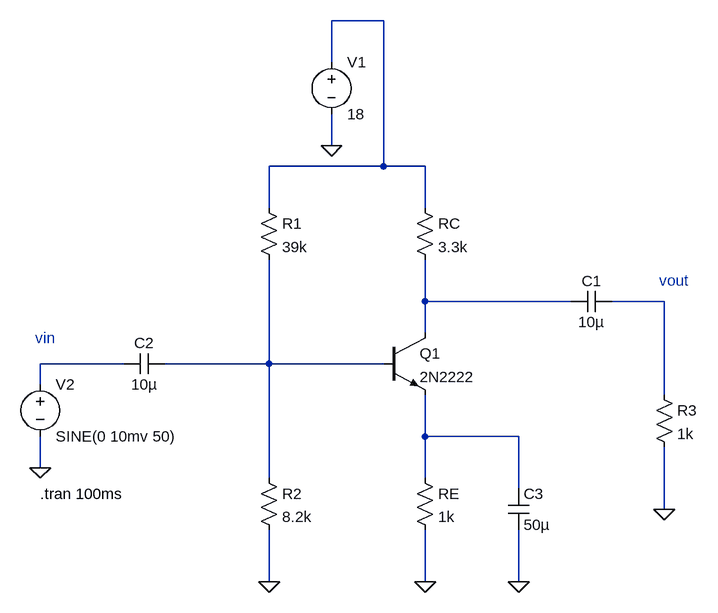
[diagram p0: schematic 4.4 BJT Voltage Divider Configuration.asc]
4.4 BJT Voltage Divider Configuration.asc, the LTspice schematic file:
Version 4
SHEET 1 948 864
WIRE 464 -16 384 -16
WIRE 384 48 384 -16
WIRE 384 176 384 128
WIRE 464 208 464 -16
WIRE 464 208 288 208
WIRE 528 208 464 208
WIRE 288 272 288 208
WIRE 528 272 528 208
WIRE 528 416 528 352
WIRE 752 416 528 416
WIRE 896 416 816 416
WIRE 528 464 528 416
WIRE 64 512 -64 512
WIRE 288 512 288 352
WIRE 288 512 128 512
WIRE 464 512 288 512
WIRE -64 544 -64 512
WIRE 896 560 896 416
WIRE 528 624 528 560
WIRE 672 624 528 624
WIRE -64 672 -64 624
WIRE 288 688 288 512
WIRE 528 688 528 624
WIRE 672 704 672 624
WIRE 896 736 896 640
WIRE 288 848 288 768
WIRE 528 848 528 768
WIRE 672 848 672 768
FLAG 288 848 0
FLAG 528 848 0
FLAG 672 848 0
FLAG 384 176 0
FLAG 896 736 0
FLAG -64 672 0
SYMBOL voltage 384 32 R0
SYMATTR InstName V1
SYMATTR Value 18
SYMBOL Res 272 256 R0
SYMATTR InstName R1
SYMATTR Value 39k
SYMBOL Res 512 256 R0
SYMATTR InstName RC
SYMATTR Value 3.3k
SYMBOL npn 464 464 R0
SYMATTR InstName Q1
SYMATTR Value 2N2222
SYMBOL Res 272 672 R0
SYMATTR InstName R2
SYMATTR Value 8.2k
SYMBOL Res 512 672 R0
SYMATTR InstName RE
SYMATTR Value 1k
SYMBOL voltage -64 528 R0
SYMATTR InstName V2
SYMATTR Value SINE(0 10mv 50)
SYMBOL Cap 816 400 R90
WINDOW 0 0 32 VBottom 2
WINDOW 3 32 32 VTop 2
SYMATTR InstName C1
SYMATTR Value 10µ
SYMBOL Cap 128 496 R90
WINDOW 0 0 32 VBottom 2
WINDOW 3 32 32 VTop 2
SYMATTR InstName C2
SYMATTR Value 10µ
SYMBOL Cap 656 704 R0
SYMATTR InstName C3
SYMATTR Value 50µ
SYMBOL Res 880 544 R0
SYMATTR InstName R3
SYMATTR Value 1k
TEXT -64 712 Left 2 !.tran 100ms
TEXT -72 472 Left 2 ;vin
TEXT 888 384 Left 2 ;vout

The netlist it stands for:
* 4.4 BJT Voltage Divider Configuration.asc
V1 N001 0 18
R1 N001 N005 39k
RC N001 N002 3.3k
Q1 N002 N005 N006 0 2N2222
R2 N005 0 8.2k
RE N006 0 1k
V2 N004 0 SINE(0 10mv 50)
C1 N003 N002 10µ
C2 N005 N004 10µ
C3 N006 0 50µ
R3 N003 0 1k
.model NPN NPN
.model PNP PNP
.lib standard.bjt
.tran 100ms
* vin
* vout
.backanno
.end